# EAGLE design ASD2162 (EAGLE 6.3)
DATABASE: ./../../../../../Components/TinyCircuits_Part_Database.txt
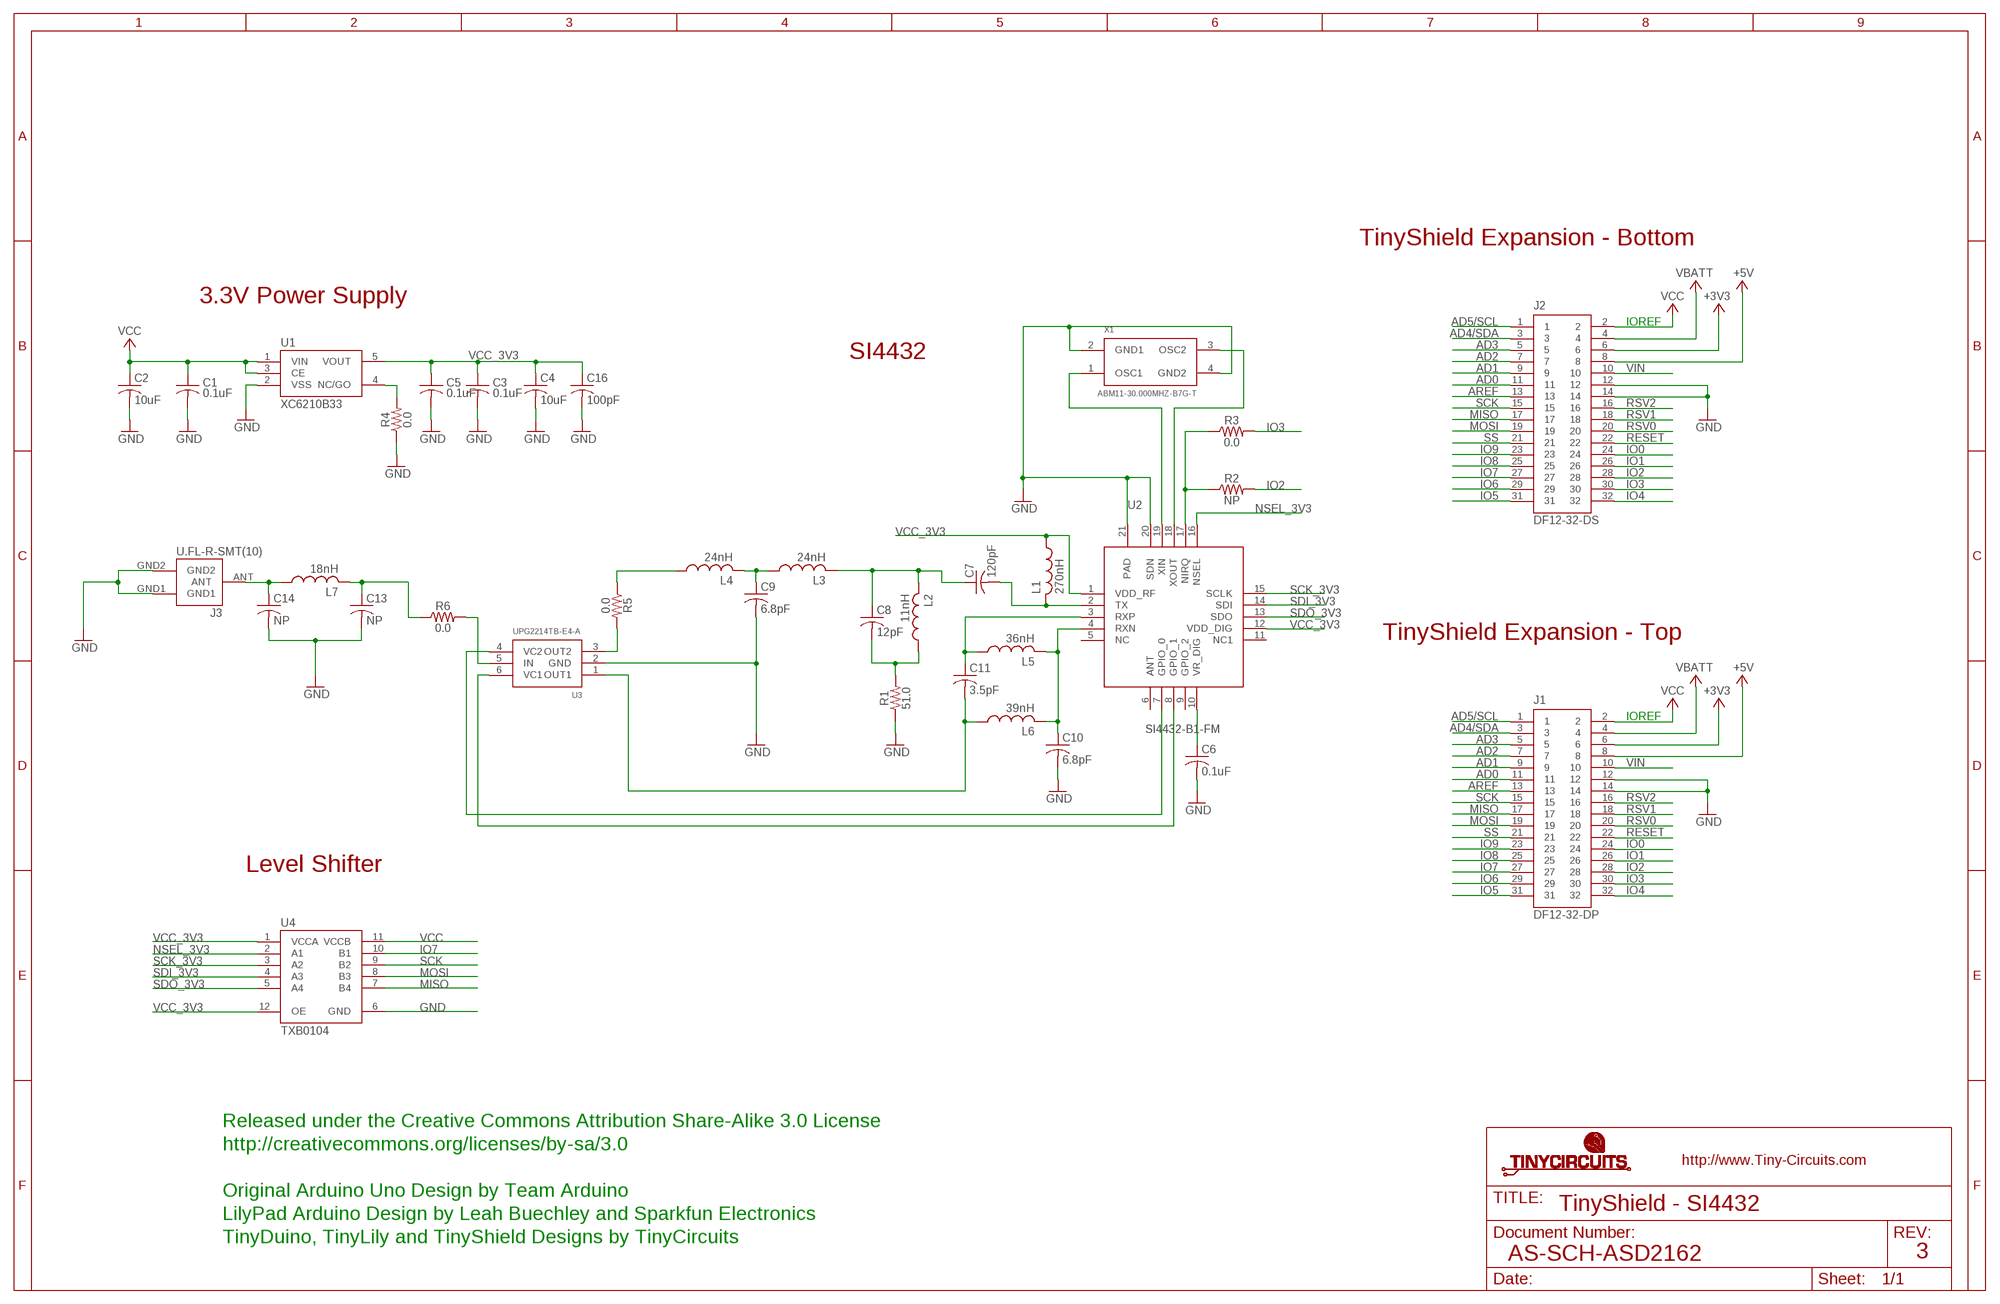
[diagram p0: schematic, sheet 1]

## Parts
C1  0.1uF  AS-ITM-00008  [C0402]
C2  10uF  AS-ITM-00045  [C0805]
C3  0.1uF  AS-ITM-00008  [C0402]
C4  10uF  AS-ITM-00045  [C0805]
C5  0.1uF  AS-ITM-00008  [C0402]
C6  0.1uF  AS-ITM-00008  [C0402]
C7  120pF  AS-ITM-00251  [C0402]
C8  12pF  AS-ITM-00261  [C0402]
C9  6.8pF  AS-ITM-00252  [C0402]
C10  6.8pF  AS-ITM-00252  [C0402]
C11  3.5pF  AS-ITM-00258  [C0402]
C13  NP  AS-ITM-00084  [C0402]
C14  NP  AS-ITM-00084  [C0402]
C16  100pF  AS-ITM-00148  [0402]
J1  DF12-32-DP  AS-ITM-00015  [DF12-32-DP]
J2  DF12-32-DS  AS-ITM-00012  [DF12-32-DS]
J3  U.FL-R-SMT(10)  AS-ITM-00193  [U.FL-R-SMT(10)]
L1  270nH  AS-ITM-00250  [C0402]
L2  11nH  AS-ITM-00254  [C0402]
L3  24nH  AS-ITM-00257  [C0402]
L4  24nH  AS-ITM-00257  [C0402]
L5  36nH  AS-ITM-00253  [C0402]
L6  39nH  AS-ITM-00259  [C0402]
L7  18nH  AS-ITM-00260  [C0402]
R1  51.0  AS-ITM-00262  [0402]
R2  NP  AS-ITM-00076  [0402]
R3  0.0  AS-ITM-00076  [0402]
R4  0.0  AS-ITM-00076  [0402]
R5  0.0  AS-ITM-00076C0402  [C0402]
R6  0.0  AS-ITM-00076C0402  [C0402]
U1  XC6210B33  AS-ITM-00046  [SOT-25]
U2  SI4432-B1-FM  AS-ITM-00194  [QFN20]
U3  UPG2214TB-E4-A  AS-ITM-00195  [S06]
U4  TXB0104  AS-ITM-00048  [UQFN-12]
X1  ABM11-30.000MHZ-B7G-T  AS-ITM-00199  [ABM11]

## Nets
+3V3: J1.6 J2.6
+5V: J1.8 J2.8
AD0: J1.11 J2.11
AD1: J1.9 J2.9
AD2: J1.7 J2.7
AD3: J1.5 J2.5
AD4/SDA: J1.3 J2.3
AD5/SCL: J1.1 J2.1
AREF: J1.13 J2.13
GND: C1.2 C2.2 C3.2 C4.2 C5.2 C6.2 C9.2 C10.2 C13.2 C14.2 C16.2 J1.12 J1.14 J2.12 J2.14 J3.GND1 J3.GND2 R1.1 R4.1 U1.2(VSS) U2.20(SDN) U2.21(PAD) U3.2(GND) U4.6(GND) X1.2(GND1) X1.4(GND2)
IO0: J1.24 J2.24
IO1: J1.26 J2.26
IO2: J1.28 J2.28 R2.2
IO3: J1.30 J2.30 R3.2
IO4: J1.32 J2.32
IO5: J1.31 J2.31
IO6: J1.29 J2.29
IO7: J1.27 J2.27 U4.10(B1)
IO8: J1.25 J2.25
IO9: J1.23 J2.23
MISO: J1.17 J2.17 U4.7(B4)
MOSI: J1.19 J2.19 U4.8(B3)
N$1: U2.19(XIN) X1.1(OSC1)
N$2: U2.18(XOUT) X1.3(OSC2)
N$3: C10.1 L5.2 L6.2 U2.4(RXN)
N$4: C7.2 L1.2 U2.2(TX)
N$6: C6.1 U2.10(VR_DIG)
N$7: C7.1 C8.1 L2.2 L3.2
N$9: C8.2 L2.1 R1.2
N$10: C9.1 L3.1 L4.2
N$11: C11.1 L5.1 U2.3(RXP)
N$12: R5.2 U3.3(OUT2)
N$13: C11.2 L6.1 U3.1(OUT1)
N$14: U2.7(GPIO_0) U3.4(VC2)
N$15: U2.8(GPIO_1) U3.6(VC1)
N$16: L4.1 R5.1
N$17: R6.2 U3.5(IN)
N$18: C13.1 L7.2 R6.1
N$19: C14.1 J3.ANT L7.1
N$20: R2.1 R3.1 U2.17(NIRQ)
N$21: R4.2 U1.4(NC/GO)
NSEL_3V3: U2.16(NSEL) U4.2(A1)
RESET: J1.22 J2.22
RSV0: J1.20 J2.20
RSV1: J1.18 J2.18
RSV2: J1.16 J2.16
SCK: J1.15 J2.15 U4.9(B2)
SCK_3V3: U2.15(SCLK) U4.3(A2)
SDI_3V3: U2.14(SDI) U4.4(A3)
SDO_3V3: U2.13(SDO) U4.5(A4)
SS: J1.21 J2.21
VBATT: J1.4 J2.4
VCC: C1.1 C2.1 J1.2 J2.2 U1.1(VIN) U1.3(CE) U4.11(VCCB)
VCC_3V3: C3.1 C4.1 C5.1 C16.1 L1.1 U1.5(VOUT) U2.1(VDD_RF) U2.12(VDD_DIG) U4.1(VCCA) U4.12(OE)
VIN: J1.10 J2.10
Unconnected: U2.5(NC) U2.6(ANT) U2.9(GPIO_2) U2.11(NC1)

## Notes on the sheet
- TinyShield Expansion - Bottom
- 3.3V Power Supply
- IOREF
- SI4432
- TinyShield Expansion - Top
- IOREF
- Level Shifter
- Released under the Creative Commons Attribution Share-Alike 3.0 License
- http://creativecommons.org/licenses/by-sa/3.0
- Original Arduino Uno Design by Team Arduino
- TinyShield - SI4432
- LilyPad Arduino Design by Leah Buechley and Sparkfun Electronics
- TinyDuino, TinyLily and TinyShield Designs by TinyCircuits
- AS-SCH-ASD2162 | 3

## Library data of the parts
C1 C3 C5 C6 = tinycircuits:AS-ITM-00008: CAP CER 0.1UF 16V 10% X5R 0402; PARTNO: AS-ITM-00008
C2 C4 = tinycircuits:AS-ITM-00045: CAP CER 16UF 16V 20% X5R 0805; PARTNO: AS-ITM-00045
C7 = tinycircuits:AS-ITM-00251: CAP CER 120PF 50V 2% NP0 0402; PARTNO: AS-ITM-00251
C8 = tinycircuits:AS-ITM-00261: CAP CER 12PF 50V 1% NP0 0402; PARTNO: AS-ITM-00261
C9 C10 = tinycircuits:AS-ITM-00252: CAP CER 6.8PF 50V NP0 0402; PARTNO: AS-ITM-00252
C11 = tinycircuits:AS-ITM-00258: CAP CER 3.5PF 50V NP0 0402; PARTNO: AS-ITM-00258
C13 C14 = tinycircuits:AS-ITM-00084: CAP CER 10NF 25V 10% X7R 0402; PARTNO: AS-ITM-00084; VALUE: 10nF
C16 = tinycircuits:AS-ITM-00148: CAP CER 100PF 50V 5% NPO 0402; PARTNO: AS-ITM-00148
J1 = tinycircuits:AS-ITM-00015: CONN HEADER 32POS 3MM SMD 0.5MM; PARTNO: AS-ITM-00015
J2 = tinycircuits:AS-ITM-00012: CONN RECEPT 32POS 3MM SMD 0.5MM; PARTNO: AS-ITM-00012
J3 = tinycircuits:AS-ITM-00193: RF COAXIAL CONNECTOR U.FL RECEPTACLE SMT; PARTNO: AS-ITM-00193
L1 = tinycircuits:AS-ITM-00250: FIXED IND 270NH 200MA 4.8 OHM; PARTNO: AS-ITM-00250
L2 = tinycircuits:AS-ITM-00254: FIXED IND 11NH 400MA 400 MOHM; PARTNO: AS-ITM-00254
L3 L4 = tinycircuits:AS-ITM-00257: FIXED IND 24NH 350MA 700 MOHM; PARTNO: AS-ITM-00257
L5 = tinycircuits:AS-ITM-00253: FIXED IND 36NH 250MA 1 OHM SMD; PARTNO: AS-ITM-00253
L6 = tinycircuits:AS-ITM-00259: FIXED IND 39NH 150MA 1.7 OHM SMD; PARTNO: AS-ITM-00259
L7 = tinycircuits:AS-ITM-00260: FIXED IND 18NH 240MA 700 MOHM; PARTNO: AS-ITM-00260
R1 = tinycircuits:AS-ITM-00262: RES SMD 51 OHM 1% 1/16W 0402; PARTNO: AS-ITM-00262
R2 = tinycircuits:AS-ITM-00076: RES 0.0 OHM 1/16W 1% 0402 SMD; PARTNO: AS-ITM-00076; VALUE: 0.0
R3-R6 = tinycircuits:AS-ITM-00076: RES 0.0 OHM 1/16W 1% 0402 SMD; PARTNO: AS-ITM-00076
U1 = tinycircuits:AS-ITM-00046: IC REG LDO 3.3V .7A SOT-25; PARTNO: AS-ITM-00046
U2 = tinycircuits:AS-ITM-00194: RF TRANSCEIVER SI4432 433 MHZ; PARTNO: AS-ITM-00194
U3 = tinycircuits:AS-ITM-00195: RF SWITCH IC 3.0V L S BAND SPDT; PARTNO: AS-ITM-00195
U4 = tinycircuits:AS-ITM-00048: IC VOLT-LEVEL TRANSLATOR 12UQFN; PARTNO: AS-ITM-00048
X1 = tinycircuits:AS-ITM-00199: ABM11 CRYSTAL 30MHZ 10PF 15PPM; PARTNO: AS-ITM-00199

## Board
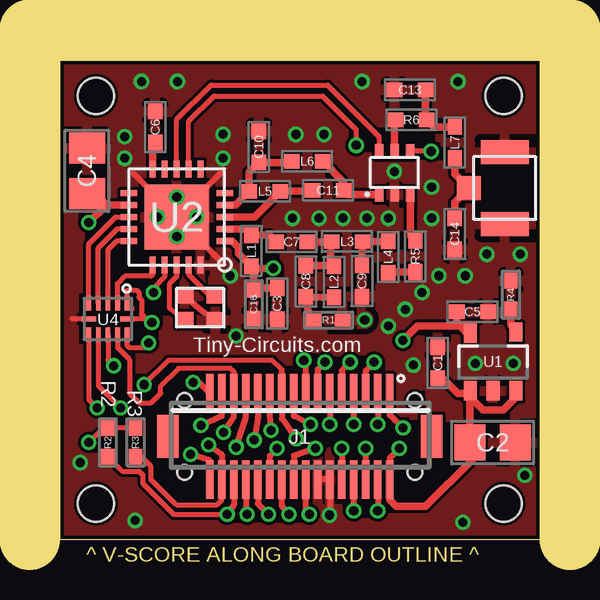
[diagram p1: board, top side]
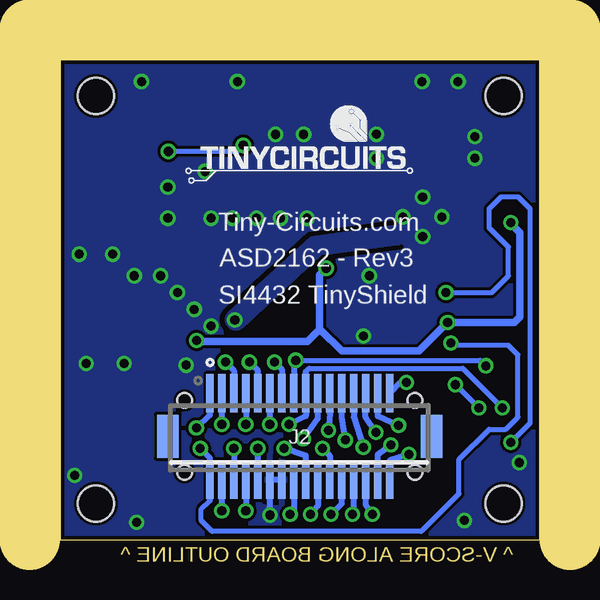
[diagram p2: board, bottom side, seen from below]

Size 20 x 20 mm. Coordinates in mm from the lower left corner, seen from the top.
Outline: 0,20 20,20 20,0 0,0 0,20
Copper layers (1*16): Top 0.035mm / dielectric 1.5mm / Bottom 0.035mm
Design rules "default *": minimum track width 5mil, minimum drill 15mil, track to track 5mil, track to pad 5mil, pad to pad 5mil, via to via 6mil, smd to smd 5mil, copper to edge 6mil, drill to drill 8mil, minimum pad ring 10mil, minimum via ring 5mil, stop-mask expansion 4mil, vias tented up to drill 25mil, thermal gap 10mil
Holes 1.5 mm at 1.5,18.5 18.5,18.5 18.5,1.5 1.5,1.5
tRestrict: 4 lines
bRestrict: 7 lines
Milling: 3 lines

### Footprints (pad centres in the part's own frame; a part is rotated, then mirrored left to right if it is on the bottom)
C0402 = smd 0.65 x 0.6: 1 -0.65,0; 2 0.65,0
C0805 = smd 1.3 x 1.5: 1 -0.95,0; 2 0.95,0
0402 = smd 0.65 x 0.55: 1 -0.6,0; 2 0.6,0
DF12-32-DP = smd 0.3 x 1.6: 1 -3.75,-1.8; 2 -3.75,1.8; 3 -3.25,-1.8; 4 -3.25,1.8; 5 -2.75,-1.8; 6 -2.75,1.8; 7 -2.25,-1.8; 8 -2.25,1.8; 9 -1.75,-1.8; 10 -1.75,1.8; 11 -1.25,-1.8; 12 -1.25,1.8; 13 -0.75,-1.8; 14 -0.75,1.8; 15 -0.25,-1.8; 16 -0.25,1.8; 17 0.25,-1.8; 18 0.25,1.8; 19 0.75,-1.8; 20 0.75,1.8; 21 1.25,-1.8; 22 1.25,1.8; 23 1.75,-1.8; 24 1.75,1.8; 25 2.25,-1.8; 26 2.25,1.8; 27 2.75,-1.8; 28 2.75,1.8; 29 3.25,-1.8; 30 3.25,1.8; 31 3.75,-1.8; 32 3.75,1.8 | smd 0.9 x 1.8: F1 -5.5,0; F2 5.5,0 | hole 0.6: -4.8,1.5; 4.8,1.5
DF12-32-DS = smd 0.3 x 1.6: 1 -3.75,1.8; 2 -3.75,-1.8; 3 -3.25,1.8; 4 -3.25,-1.8; 5 -2.75,1.8; 6 -2.75,-1.8; 7 -2.25,1.8; 8 -2.25,-1.8; 9 -1.75,1.8; 10 -1.75,-1.8; 11 -1.25,1.8; 12 -1.25,-1.8; 13 -0.75,1.8; 14 -0.75,-1.8; 15 -0.25,1.8; 16 -0.25,-1.8; 17 0.25,1.8; 18 0.25,-1.8; 19 0.75,1.8; 20 0.75,-1.8; 21 1.25,1.8; 22 1.25,-1.8; 23 1.75,1.8; 24 1.75,-1.8; 25 2.25,1.8; 26 2.25,-1.8; 27 2.75,1.8; 28 2.75,-1.8; 29 3.25,1.8; 30 3.25,-1.8; 31 3.75,1.8; 32 3.75,-1.8 | smd 0.9 x 1.8: F1 -5.5,0; F2 5.5,0 | hole 0.6: -4.8,1.5; 4.8,1.5
U.FL-R-SMT(10) = smd 1 x 1: ANT 0,-1.5 | smd 1 x 2: GND1 -1.5,0; GND2 1.5,0
SOT-25 = smd 0.55 x 0.8: 1 -0.95,-1.2; 2 0,-1.2; 3 0.95,-1.2; 4 0.95,1.25; 5 -0.95,1.2
QFN20 = smd 0.7 x 0.25: 1 -2,1; 2 -2,0.5; 3 -2,0; 4 -2,-0.5; 5 -2,-1; 11 2,-1; 12 2,-0.5; 13 2,0; 14 2,0.5; 15 2,1 | smd 0.25 x 0.7: 6 -1,-2; 7 -0.5,-2; 8 0,-2; 9 0.5,-2; 10 1,-2; 16 1,2; 17 0.5,2; 18 0,2; 19 -0.5,2; 20 -1,2 | smd 2.7 x 2.7: 21 0,0
S06 = smd 0.6 x 0.35: 1 -0.9,0.65; 2 -0.9,0; 3 -0.9,-0.65; 4 0.9,-0.65; 5 0.9,0; 6 0.9,0.65
UQFN-12 = smd 0.2 x 0.6: 1 -0.8,-0.65; 2 -0.4,-0.65; 3 0,-0.65; 4 0.4,-0.65; 5 0.8,-0.65; 7 0.8,0.65; 8 0.4,0.65; 9 0,0.65; 10 -0.4,0.65; 11 -0.8,0.65 | smd 0.6 x 0.2: 6 0.8,0; 12 -0.8,0
ABM11 = smd 0.75 x 0.65: 1 -0.65,-0.5; 2 0.65,-0.5; 3 0.65,0.5; 4 -0.65,0.5

### Placement (x,y rotation side)
C1  15.76,7.37 90 top
C2  18.04,4.05 0 top
C3  9.06,9.84 270 top
C4  1.13,15.38 90 top
C5  17.2,9.5 0 top
C6  3.98,17.2 90 top
C7  9.66,12.41 180 top
C8  10.26,10.77 270 top
C9  12.6,10.78 270 top
C10  8.3,16.37 90 top
C11  11.18,14.56 0 top
C13  14.6,18.75 180 top
C14  16.46,12.74 270 top
C16  8.08,9.81 270 top
J1  10,4.3 180 top
J2  10,4.3 0 bottom
J3  18.55,14.66 270 top
L1  7.99,12.04 90 top
L2  11.43,10.75 90 top
L3  11.98,12.43 180 top
L4  13.68,11.78 90 top
L5  8.54,14.52 180 top
L6  10.31,15.78 180 top
L7  16.47,16.56 90 top
R1  11.19,9.16 180 top
R2  2,4.05 270 top
R3  3.15,4.05 270 top
R4  18.8,10.2 270 top
R5  14.82,11.81 90 top
R6  14.65,17.5 180 top
U1  18.06,7.41 0 top
U2  4.87,13.45 180 top
U3  13.96,15.29 90 top
U4  2,9.2 180 top
U$1  [DOCFIELD-TINYCIRCUITS-PCB]  33.91,-10 0 top  (outside the outline)
X1  5.85,9.66 180 top

### Tracks (layer width: path | path; a pad name or v marks a point on that pad's centre or on a via)
+3V3  (via drill 0.38)
  Top 0.254: J2.6 v12.75,3.8
  Bottom 0.254: v12.75,3.8 J2.6
+5V  (via drill 0.38)
  Top 0.254: v12.25,1.2 J2.8
  Bottom 0.254: J2.8 v12.25,1.2
AD0  (via drill 0.38)
  Top 0.254: J2.11 v11.25,4.8
  Bottom 0.254: v11.25,4.8 J2.11
AD1  (via drill 0.38)
  Top 0.254: v12.1,7.4 11.75,7.05 J2.9
  Bottom 0.254: J2.9 11.75,7.05 v12.1,7.4
AD2  (via drill 0.38)
  Top 0.254: v12.25,4.8 J2.7
  Bottom 0.254: J2.7 v12.25,4.8
AD3  (via drill 0.38)
  Top 0.254: J2.5 12.75,7.05 v13.1,7.4
  Bottom 0.254: v13.1,7.4 12.75,7.05 J2.5
AD4/SDA  (via drill 0.38)
  Top 0.254: J2.3 v13.25,4.8
  Bottom 0.254: v13.25,4.8 J2.3
AD5/SCL  (via drill 0.38)
  Top 0.254: J2.1 13.75,5.19 v14.31,4.66
  Bottom 0.254: v14.31,4.66 13.75,5.19 J2.1
AREF  (via drill 0.38)
  Top 0.254: J2.13 10.75,7.1 v11.05,7.4
  Bottom 0.254: v11.05,7.4 10.75,7.1 J2.13
GND  (via drill 0.38)
  Top 0.203: U4.6 0.5,9.2
  Top 0.254: U1.2 | v11.23,1.02 11.25,1.04 J2.12 11.23,2.52 11.2,2.52 | X1.4 5.97,9.49 X1.2 | 6.74,11.59 6.71,11.59 4.87,13.43 U2.21 | 3.06,15.27 3.74,14.59 3.74,14.56 4.85,13.45 U2.21 | 6.71,15.32 6.71,15.3 U2.21 | 10.75,2.52 11.2,2.52 | 11.2,2.52 11.26,2.52
  Bottom 0.254: v11.23,1.02 11.23,2.48 J2.12 J2.14
  other vias: 0.85,3.21 16.8,0.72 19.39,2.68 19.2,11.9 17.8,11.9 18.9,7.34 17.32,7.34 14.74,7.28 13.7,8.9 14.4,9.6 15.8,11 4.07,13.45 4.87,14.28 5.69,13.45 4.87,12.63 9.7,13.4 10.8,13.4 11.8,13.4 12.8,13.4 13.7,13.4 15.5,14.7 15.5,13.4 11.01,16.9 9.84,16.9 6.8,16.9 6.8,15.9 2.7,15.9 2.7,16.8 12.6,19.1 16.6,19.1 7.1,11 3.13,0.79 13.95,15.35 7.35,8.49 3.4,19.1 4.9,19.1 12.71,9.15 16.9,11 15.1,10.3
  pour Top: 0,20 20,20 20,0 0,0
  pour Bottom: 0,20 20,20 20,0 0,0
IO0  (via drill 0.38)
  Top 0.254: J2.24 8.25,1.5 v8.7,1.05
  Bottom 0.254: J2.24 8.25,1.5 v8.7,1.05
IO1  (via drill 0.38)
  Top 0.254: J2.26 7.75,1.1 v7.8,1.05
  Bottom 0.254: v7.8,1.05 7.75,1.1 J2.26
IO2  (via drill 0.38)
  Top 0.203: R2.2 2.6,2.85 3.3,2.85 3.45,2.7 3.45,2.35 4.75,1.05 v6.98,1.05
  Top 0.254: J2.28 7.25,1.45 v6.98,1.05
  Bottom 0.254: v6.98,1.05 7.25,1.45 J2.28
IO3  (via drill 0.38)
  Top 0.203: J2.30 6.75,1.65 6.55,1.45 4.85,1.45 3.8,2.5 3.8,3.05 3.4,3.45 R3.2
  Top 0.254: J2.30 6.75,3.55 v6.2,3.95
  Bottom 0.254: J2.30 6.75,3.55 v6.2,3.95
IO4  (via drill 0.38)
  Top 0.254: J2.32 6.25,3.3 v5.45,3.55
  Bottom 0.254: v5.45,3.55 6.25,3.3 J2.32
IO5  (via drill 0.38)
  Top 0.254: J2.31 5.8,6.55 v5.55,6.55
  Bottom 0.254: v5.55,6.55 5.8,6.55 J2.31
IO6  (via drill 0.38)
  Top 0.254: J2.29 6.75,5.15 v5.88,4.76
  Bottom 0.254: v5.88,4.76 6.75,5.15 J2.29
IO7  (via drill 0.38)
  Top 0.203: 7.25,6.99 7.09,7.14 4.95,7.14 4.2,6.4 4.2,6.1 3.8,5.7 3.3,5.7 2.9,6.1 2.9,7.5 2.4,8 U4.10
  Top 0.254: v6.83,4.47 7.26,5.11 J2.27 7.25,6.99
  Bottom 0.254: J2.27 7.26,5.11 v6.83,4.47
IO8  (via drill 0.38)
  Top 0.254: v7.35,3.85 7.75,5.1 J2.25
  Bottom 0.254: J2.25 7.75,5.1 v7.35,3.85
IO9  (via drill 0.38)
  Top 0.254: J2.23 8.25,5.1 v8.1,4.15
  Bottom 0.254: v8.1,4.15 8.25,5.1 J2.23
MISO  (via drill 0.38)
  Top 0.203: v1.56,5.49 1.2,5.85 U4.7
  Top 0.254: v10.45,4.8 9.75,5.15 J2.17
  Bottom 0.203: 9.75,7 9.61,7.14 3.21,7.14 v1.56,5.49
  Bottom 0.254: 9.75,7 J2.17 9.75,5.15 v10.45,4.8
MOSI  (via drill 0.38)
  Top 0.203: 9.25,7.07 8.85,7.48 4.53,7.48 v3.51,6.46 | v2.53,5.49 1.6,6.41 U4.8
  Top 0.254: 9.25,7.07 J2.19 9.25,5.05 v9.85,4.2
  Bottom 0.203: v3.51,6.46 3.46,6.42 v2.53,5.49
  Bottom 0.254: v9.85,4.2 9.25,5.05 J2.19
N$1
  Top 0.203: U2.19 5.37,11.05 6.26,10.16 X1.1
N$2
  Top 0.203: U2.18 4.87,10.97 4.55,10.65 4.55,9.65 X1.3
N$3
  Top 0.305: U2.4 7.32,13.95 L5.2 7.89,15.32 C10.1 9.61,15.72 L6.2
N$4
  Top 0.305: C7.2 8.74,12.69 L1.2 7.72,12.95 U2.2
N$6
  Top 0.305: U2.10 3.87,16.45 arc-90 C6.1
N$7
  Top 0.305: C7.1 11.24,12.41 L3.2 11.25,11.58 L2.2 11.4,11.42 C8.1
N$9
  Top 0.305: L2.1 10.36,10.12 C8.2 10.36,9.39 R1.2
N$10
  Top 0.305: C9.1 12.55,11.49 L3.1 12.55,12.43 L4.2
N$11
  Top 0.305: C11.1 10.49,14.52 L5.1 8.12,13.45 U2.3
N$12
  Top 0.305: U3.3 14.61,12.67 R5.2
N$13
  Top 0.305: L6.1 11.83,14.91 C11.2 12,14.39 U3.1
N$14  (via drill 0.38)
  Top 0.203: U2.7 5.37,17.44 6.43,18.5 10.95,18.5 12.35,17.1 v12.35,16.44 | v15.48,16.19 v15.47,16.19 U3.4
  Bottom 0.203: v12.35,16.44 12.61,16.19 v15.48,16.19
N$15
  Top 0.203: U2.8 4.87,17.52 6.31,18.96 11.16,18.96 13.31,16.81 U3.6
N$16
  Top 0.305: L4.1 13.61,11.16 R5.1
N$17
  Top 0.305: U3.5 13.96,17.46 R6.2
N$18
  Top 0.254: C13.1 15.3,18.75
  Top 0.305: C13.1 15.25,17.55 R6.1 15.59,17.21 L7.2
N$19
  Top 0.305: L7.1 16.47,15.25 J3.ANT 16.46,14.08 C14.1
N$20  (via drill 0.38)
  Top 0.203: U2.17 4.37,10.97 3.9,10.5 v3.9,10.3 | R3.1 R2.1 | 1.85,4.65 v1.2,4.05
  Top 0.305: 1.85,4.65 R2.1
  Bottom 0.203: v3.9,10.3 2,10.3 1.3,11 1.3,12.2 2.1,13 2.1,13.8 1.6,14.3 0.9,14.3 0.4,13.8 0.4,4.85 v1.2,4.05
N$21
  Top 0.305: U1.4 18.8,8.97 R4.2
NSEL_3V3
  Top 0.203: U2.16 3.87,11.06 3.79,10.98 2.7,10.98 2.4,10.68 U4.2
RESET  (via drill 0.38)
  Top 0.254: J2.22 8.75,3.5 v9.05,3.8
  Bottom 0.254: v9.05,3.8 8.75,3.5 J2.22
RSV0  (via drill 0.38)
  Top 0.254: v9.55,1.05 9.25,1.4 J2.20
  Bottom 0.254: J2.20 9.25,1.4 v9.55,1.05
RSV1  (via drill 0.38)
  Top 0.254: 9.74,2.51 J2.18 9.75,3.5 v10.65,3.8
  Bottom 0.254: J2.18 9.75,3.5 v10.65,3.8
RSV2  (via drill 0.38)
  Top 0.254: v10.4,1.05 10.25,1.2 J2.16
  Bottom 0.254: J2.16 10.25,1.2 v10.4,1.05
SCK  (via drill 0.38)
  Top 0.203: 2,7.49 v2.24,7.25 2,7.49 U4.9
  Top 0.254: J2.15 10.25,7.39 v10.17,7.48
  Bottom 0.203: v10.17,7.48 2.47,7.48 v2.24,7.25
  Bottom 0.254: v10.17,7.48 10.25,7.39 J2.15
SCK_3V3
  Top 0.203: U2.15 2.37,12.45 2,12.08 U4.3
SDI_3V3
  Top 0.203: U2.14 2.39,12.95 1.6,12.17 1.6,12.16 U4.4
SDO_3V3
  Top 0.203: U2.13 2.33,13.45 1.2,12.33 1.2,10.1 U4.5
SS  (via drill 0.38)
  Top 0.254: v8.8,4.55 8.75,5.25 J2.21
  Bottom 0.254: J2.21 8.75,5.25 v8.8,4.55
VBATT  (via drill 0.38)
  Top 0.254: J2.4 v13.25,1.2
  Bottom 0.254: v13.25,1.2 J2.4
VCC  (via drill 0.38)
  Top 0.203: v3.7,8.2 3.5,8 2.9,8 2.8,8.1 U4.11 | 17.11,6.06 U1.1 17.11,6.05 17.16,6.05
  Top 0.254: C2.1 17.12,4.68 | v14.15,3.8 13.75,3.4 J2.2
  Top 0.305: C2.1 17.19,3.32 15.25,1.38 14.03,1.38 13.75,1.66 J2.2 | 17.12,4.68 17.1,4.7 U1.1 17.16,6.05 | C1.1 15.98,6.72 16.6,6.1 17.1,6.1 17.11,6.06 | U1.3 19.01,5.93 18.49,5.41 17.63,5.41 17.11,5.93 U1.1
  Bottom 0.203: 13.75,1.63 14.11,1.28 14.11,0.79 13.65,0.34 4.94,0.34 3.36,1.91 3.36,3.34 2.1,4.6 1.4,4.6 0.9,5.1 0.9,7.7 1.3,8.1 3.6,8.1 v3.7,8.2
  Bottom 0.254: 13.75,1.63 J2.2 13.75,3.4 v14.15,3.8
VCC_3V3  (via drill 0.38)
  Top 0.203: U4.1 2.8,10.4 3.2,10.4 3.3,10.3 3.3,10.1 3.4,10 3.4,9.4 3.6,9.2 | 3.6,9.2 U4.12 | 3.6,9.2 3.85,8.95 v3.83,9.05
  Top 0.305: U1.5 17.04,8.54 | 17.04,8.54 17.14,8.64 16.9,8.7 16.7,8.9 14.9,8.9 v14.3,8.3 | v1.2,13.22 1.94,13.95 | 1.94,13.95 U2.12 | v8.9,11.31 8.06,11.31 | 8.06,11.31 L1.1 7.45,11.92 7.45,12.17 7.17,12.45 U2.1 | 8.06,11.31 8.06,10.49 C16.1 8.06,10.49 C3.1 | 1.94,13.95 1.47,14.46 C4.1 | 17.04,8.54 16.55,9.05 C5.1
  Bottom 0.305: v14.3,8.3 14.36,8.26 9.68,8.26 9.18,8.77 | 9.18,8.77 9.15,8.77 8.24,7.86 5.03,7.86 v3.83,9.05 1.05,9.05 0.82,9.28 0.82,12.81 1.3,13.29 v1.2,13.22 | 9.18,8.77 9.18,11.03 v8.9,11.31
VIN  (via drill 0.38)
  Top 0.254: v11.75,3.8 J2.10
  Bottom 0.254: J2.10 v11.75,3.8

### Text on the board
Dimension: ^ V-SCORE ALONG BOARD OUTLINE ^
tPlace: Tiny-Circuits.com | R2 | R3
bPlace: Tiny-Circuits.com | ASD2162 - Rev3 | SI4432 TinyShield
Document: FABRICATION DRAWING | NOTES: | 1. PRINTED CIRCUIT BOARD MADE FROM NEMA GRADE FR-4 EPOXY LAMINATE | WITH 1 OUNCE COPPER PLATING AND .024 THICKNESS. | 2. ALL DIMENSIONS ARE GIVEN IN INCHES. | 3. CIRCUIT PATHS ARE FOR REFERENCE ONLY. | 4. HOLE SIZES SHOWN ARE FINISHED DIAMETERS AFTER PLATING. | 5. BOARD PLATED USING REFLOW OR SIMILAR METHOD. | 6. BOARD TO HAVE BLUE SOLDER MASK ON PLATED SURFACES USING WET FILM | 7. SILKSCREEN BOARD USING WHITE INK. | SR100 OR SR1010 EPOXY. EQUIVALENT WET OR DRY FILM MAY BE USED. | 8. THE FOLLOWING INFORMATION APPLIES TO THIS BOARD: | * 2 COPPER LAYERS | * .024 BOARD THICKNESS | * REQUIRES TOP SIDE SILKSCREEN | Released under the Creative Commons Attribution Share-Alike 3.0 License | http://creativecommons.org/licenses/by-sa/3.0 | Original Arduino Uno Design by Team Arduino | LilyPad Arduino Design by Leah Buechley and Sparkfun Electronics | TinyDuino, TinyLily and TinyShield Designs by TinyCircuits | TinyShield - SI4432 | AS-PCB-ASD2162 | 3